# EasyEDA schematic Sheet_2.json
TITLE: Sheet_2; REV: 1.0; Date: 2024-01-28; Sheet: 1/1; Drawn By: Qinh; Company: Your Company
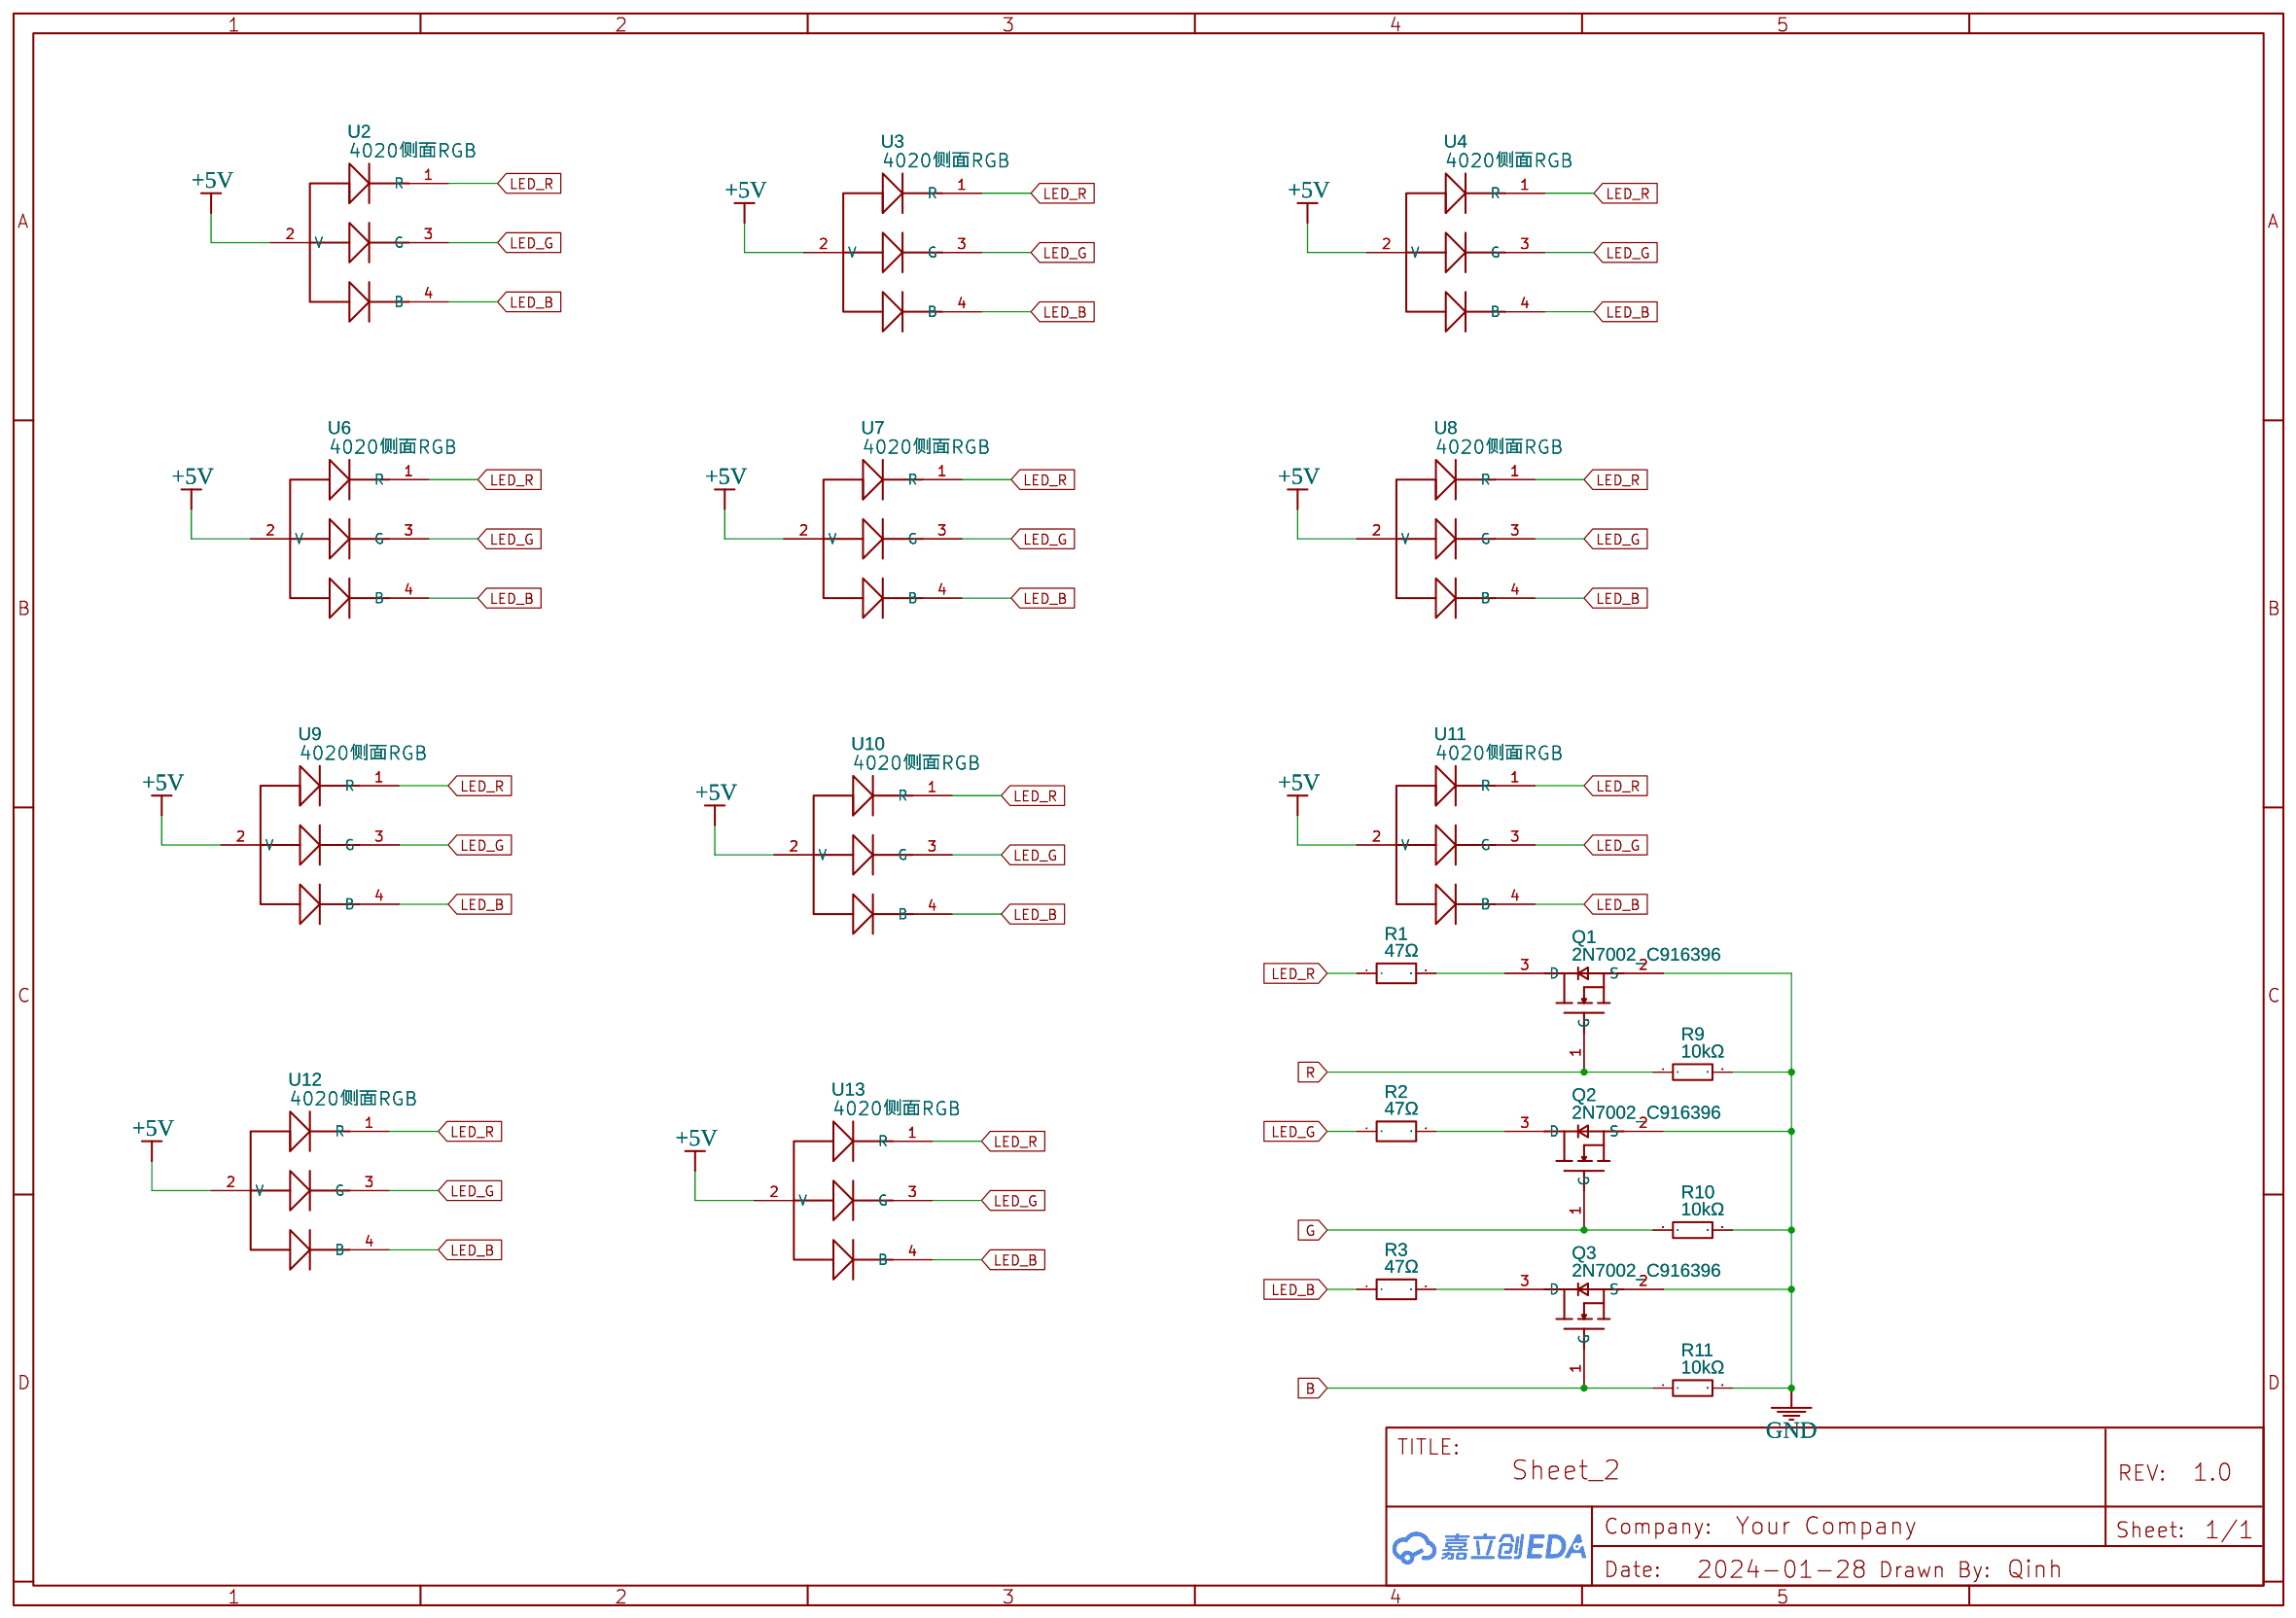
[diagram p0: schematic sheet]

## Parts
Q1  2N7002_C916396  [SOT-23-3_L2.9-W1.3-P1.90-LS2.4-BR]
Q2  2N7002_C916396  [SOT-23-3_L2.9-W1.3-P1.90-LS2.4-BR]
Q3  2N7002_C916396  [SOT-23-3_L2.9-W1.3-P1.90-LS2.4-BR]
R1  47Ω  [R0603]
R2  47Ω  [R0603]
R3  47Ω  [R0603]
R9  10kΩ  [R0603]
R10  10kΩ  [R0603]
R11  10kΩ  [R0603]
U2  4020侧面RGB  [4020侧面RGB]
U3  4020侧面RGB  [4020侧面RGB]
U4  4020侧面RGB  [4020侧面RGB]
U6  4020侧面RGB  [4020侧面RGB]
U7  4020侧面RGB  [4020侧面RGB]
U8  4020侧面RGB  [4020侧面RGB]
U9  4020侧面RGB  [4020侧面RGB]
U10  4020侧面RGB  [4020侧面RGB]
U11  4020侧面RGB  [4020侧面RGB]
U12  4020侧面RGB  [4020侧面RGB]
U13  4020侧面RGB  [4020侧面RGB]

## Library data of the parts
Q1-Q3 = 2N7002_C916396: Contributor: LCSC; Supplier: LCSC; Supplier Part: C916396; Manufacturer: JSMSEMI(杰盛微); JLCPCB Part Class: Extended Part
R1-R3 = CRCW060347R0FKEA: Contributor: LCSC; Supplier: LCSC; Supplier Part: C511383; Manufacturer: VISHAY(威世); JLCPCB Part Class: Extended Part
R9-R11 = 0603WAF1002T5E: Supplier: LCSC; Manufacturer: UNI-ROYAL(厚声); Supplier Part: C25804; JLCPCB Part Class: Basic Part
U2-U4 U6-U13 = 4020侧面RGB: Contributor: jiaozhuasama

## Nets
+5V: U2.2(V) U3.2(V) U4.2(V) U6.2(V) U7.2(V) U8.2(V) U9.2(V) U10.2(V) U11.2(V) U12.2(V) U13.2(V)
GND: Q1.2(S) Q2.2(S) Q3.2(S) R9.2 R10.2 R11.2
B: Q3.1(G) R11.1
G: Q2.1(G) R10.1
LED_B: R3.1 U2.4(B) U3.4(B) U4.4(B) U6.4(B) U7.4(B) U8.4(B) U9.4(B) U10.4(B) U11.4(B) U12.4(B) U13.4(B)
LED_G: R2.1 U2.3(G) U3.3(G) U4.3(G) U6.3(G) U7.3(G) U8.3(G) U9.3(G) U10.3(G) U11.3(G) U12.3(G) U13.3(G)
LED_R: R1.1 U2.1(R) U3.1(R) U4.1(R) U6.1(R) U7.1(R) U8.1(R) U9.1(R) U10.1(R) U11.1(R) U12.1(R) U13.1(R)
R: Q1.1(G) R9.1
Net-(Q1-3): Q1.3(D) R1.2
Net-(Q2-3): Q2.3(D) R2.2
Net-(Q3-3): Q3.3(D) R3.2
